# Altium schematic sheet SDRAM.SchDoc
size A4; SheetNumber: 2; SheetTotal: 4
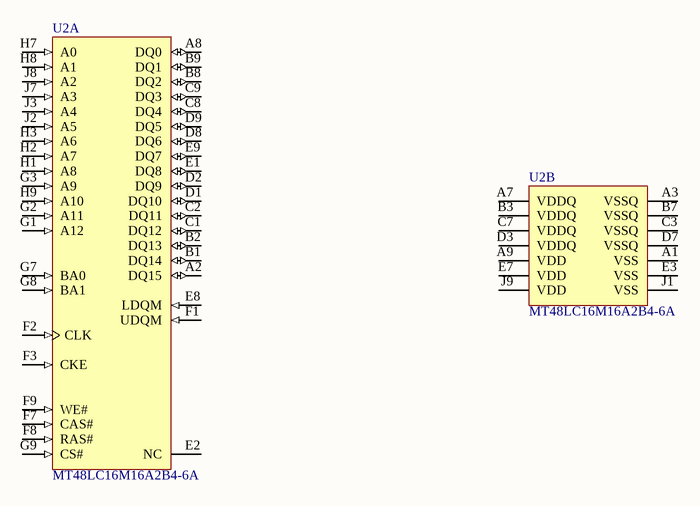
[diagram p0: SDRAM.SchDoc]

## Parts
U2  MT48LC16M16A2B4-6A  [MICT-B4-54]  (parts A,B of 2)

## Nets

Not connected (* = marked no-connect by the designer): U2 A1(VSS) A2(DQ15) A3(VSSQ) A7(VDDQ) A8(DQ0) A9(VDD) B1(DQ14) B2(DQ13) B3(VDDQ) B7(VSSQ) B8(DQ2) B9(DQ1) C1(DQ12) C2(DQ11) C3(VSSQ) C7(VDDQ) C8(DQ4) C9(DQ3) D1(DQ10) D2(DQ9) D3(VDDQ) D7(VSSQ) D8(DQ6) D9(DQ5) E1(DQ8) E2(NC) E3(VSS) E7(VDD) E8(LDQM) E9(DQ7) F1(UDQM) F2(CLK) F3(CKE) F7(CAS#) F8(RAS#) F9(WE#) G1(A12) G2(A11) G3(A9) G7(BA0) G8(BA1) G9(CS#) H1(A8) H2(A7) H3(A6) H7(A0) H8(A1) H9(A10) J1(VSS) J2(A5) J3(A4) J7(A3) J8(A2) J9(VDD)

## Library data of the parts
U2 = CMP-0351-00014-1: 256Mb PC133 SDR SDRAM, 16Mb x 16, 6ns, 3.3V, 0 to 70 degC, 54-Ball VFBGA, Pb-Free; Manufacturer: Micron; Data Rate: PC133Â; CL: CL = 3Â; Clock Rate: 166 MHzÂ; Cycle Time: 6nsÂ; Density: 256MbÂ; Voltage: 3.3VÂ; Op. Temp.: 0C to +70CÂ; PackageReference: MICT-B4-54; PartNumber: MT48LC16M16A2B4-6A; ComponentLink1URL: http://www.micron.com/; Mounting Technology: Surface Mount; DatasheetVersion: Rev.Q; ComponentLink1Description: Manufacturer URL; RoHS: YesÂ; Depth: 16MbÂ; ComponentLink2URL: http://www.micron.com/~/media/Documents/Products/Data%20Sheet/DRAM/256Mb_sdr.pdf; ComponentLink2Description: Datasheet; PackageDescription: 54-Ball Very Thin Profile Fine-Pitch Ball Grid Array, 8x 8 mm, Pitch 0.8 mm; ComponentLink3Description: Package Specification; Width: x16Â; ComponentLink3URL: http://www.micron.com/~/media/Documents/Products/Data%20Sheet/DRAM/128Mbx16x32Mobile.pdf; PackageVersion: Rev.Q